# Altium project 十二进十二出.PrjPcb
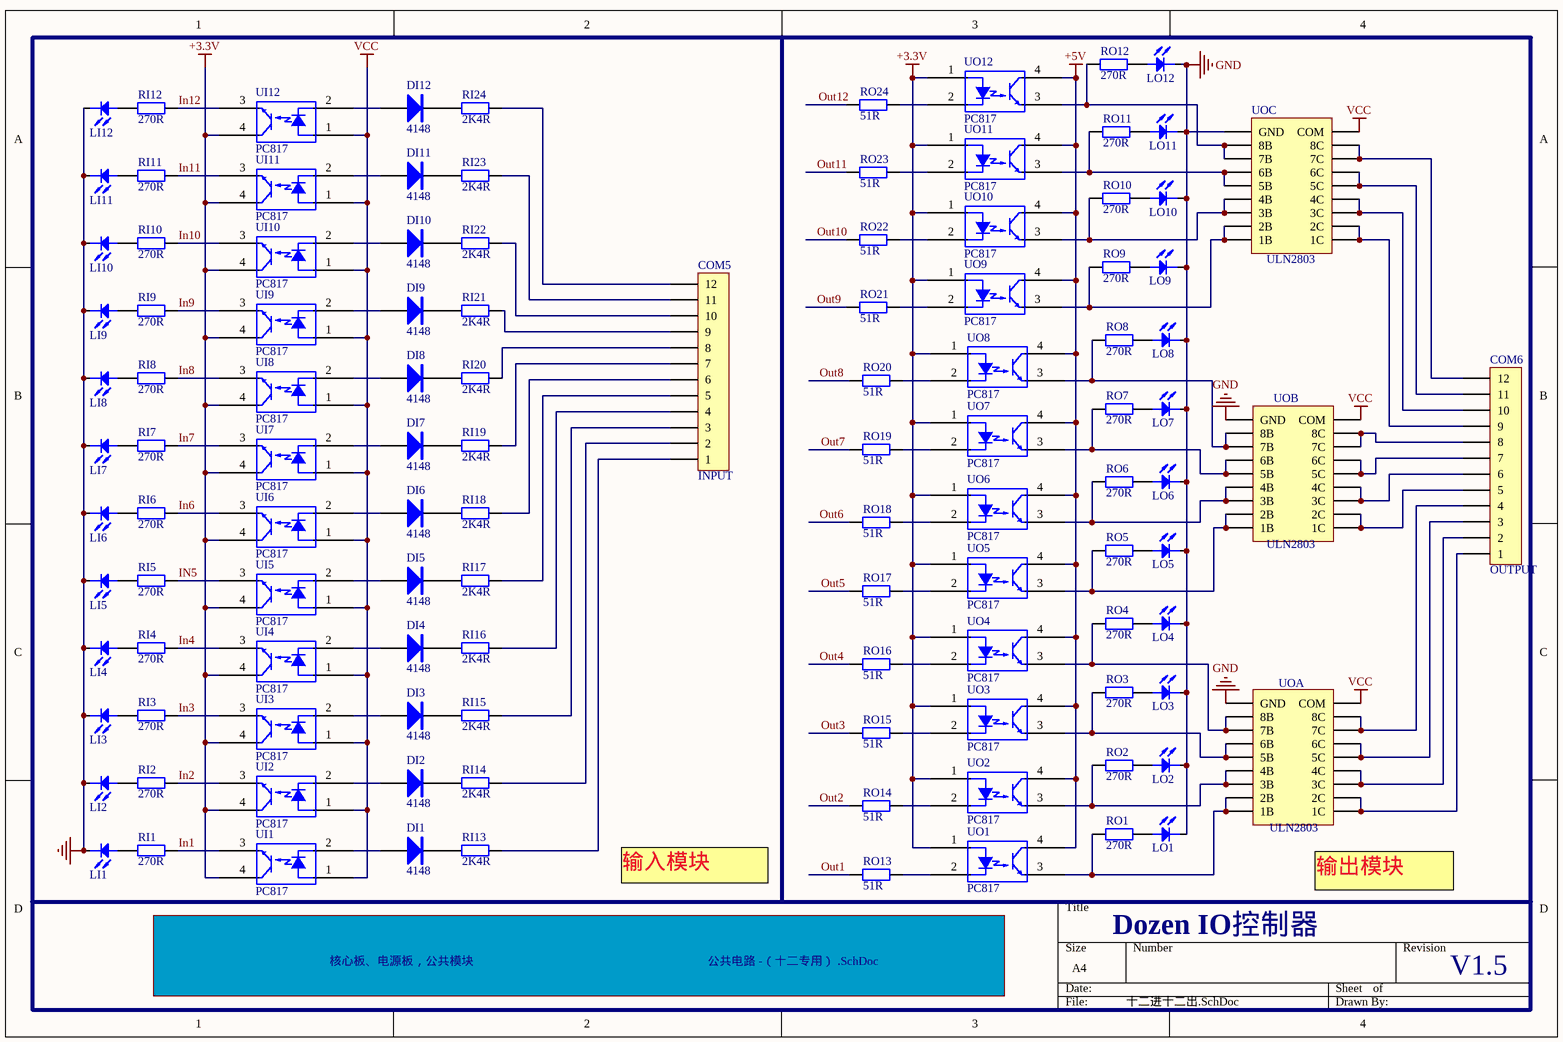
[diagram p0: 十二进十二出.SchDoc]
2 sheets, 184 parts. Net scope: global (net labels, ports and power ports of the same name join across sheets).
Board file: 十二进十二出 .PcbDoc
Sheets:
  十二进十二出.SchDoc
    核心板、电源板，公共模块 = 公共电路 -（十二专用） .SchDoc

## Sheet 十二进十二出.SchDoc: Dozen IO控制器
size A4; Revision: V1.5; SheetNumber: 0; SheetTotal: 0; DrawnBy: 小熊

### Parts
COM5  INPUT  [CON12-5.1卧上]
COM6  OUTPUT  [CON12-5.1卧下]
DI1  4148  [1206C]
DI2  4148  [1206C]
DI3  4148  [1206C]
DI4  4148  [1206C]
DI5  4148  [1206C]
DI6  4148  [1206C]
DI7  4148  [1206C]
DI8  4148  [1206C]
DI9  4148  [1206C]
DI10  4148  [1206C]
DI11  4148  [1206C]
DI12  4148  [1206C]
LI1  LED  [SMDLED]  (value not drawn)
LI2  LED  [SMDLED]  (value not drawn)
LI3  LED  [SMDLED]  (value not drawn)
LI4  LED  [SMDLED]  (value not drawn)
LI5  LED  [SMDLED]  (value not drawn)
LI6  LED  [SMDLED]  (value not drawn)
LI7  LED  [SMDLED]  (value not drawn)
LI8  LED  [SMDLED]  (value not drawn)
LI9  LED  [SMDLED]  (value not drawn)
LI10  LED  [SMDLED]  (value not drawn)
LI11  LED  [SMDLED]  (value not drawn)
LI12  LED  [SMDLED]  (value not drawn)
LO1  LED  [SMDLED]  (value not drawn)
LO2  LED  [SMDLED]  (value not drawn)
LO3  LED  [SMDLED]  (value not drawn)
LO4  LED  [SMDLED]  (value not drawn)
LO5  LED  [SMDLED]  (value not drawn)
LO6  LED  [SMDLED]  (value not drawn)
LO7  LED  [SMDLED]  (value not drawn)
LO8  LED  [SMDLED]  (value not drawn)
LO9  LED  [SMDLED]  (value not drawn)
LO10  LED  [SMDLED]  (value not drawn)
LO11  LED  [SMDLED]  (value not drawn)
LO12  LED  [SMDLED]  (value not drawn)
RI1  270R  [0603A]
RI2  270R  [0603A]
RI3  270R  [0603A]
RI4  270R  [0603A]
RI5  270R  [0603A]
RI6  270R  [0603A]
RI7  270R  [0603A]
RI8  270R  [0603A]
RI9  270R  [0603A]
RI10  270R  [0603A]
RI11  270R  [0603A]
RI12  270R  [0603A]
RI13  2K4R  [0603A]
RI14  2K4R  [0603A]
RI15  2K4R  [0603A]
RI16  2K4R  [0603A]
RI17  2K4R  [0603A]
RI18  2K4R  [0603A]
RI19  2K4R  [0603A]
RI20  2K4R  [0603A]
RI21  2K4R  [0603A]
RI22  2K4R  [0603A]
RI23  2K4R  [0603A]
RI24  2K4R  [0603A]
RO1  270R  [0603A]
RO2  270R  [0603A]
RO3  270R  [0603A]
RO4  270R  [0603A]
RO5  270R  [0603A]
RO6  270R  [0603A]
RO7  270R  [0603A]
RO8  270R  [0603A]
RO9  270R  [0603A]
RO10  270R  [0603A]
RO11  270R  [0603A]
RO12  270R  [0603A]
RO13  51R  [0603A]
RO14  51R  [0603A]
RO15  51R  [0603A]
RO16  51R  [0603A]
RO17  51R  [0603A]
RO18  51R  [0603A]
RO19  51R  [0603A]
RO20  51R  [0603A]
RO21  51R  [0603A]
RO22  51R  [0603A]
RO23  51R  [0603A]
RO24  51R  [0603A]
UI1  PC817  [PC817]
UI2  PC817  [PC817]
UI3  PC817  [PC817]
UI4  PC817  [PC817]
UI5  PC817  [PC817]
UI6  PC817  [PC817]
UI7  PC817  [PC817]
UI8  PC817  [PC817]
UI9  PC817  [PC817]
UI10  PC817  [PC817]
UI11  PC817  [PC817]
UI12  PC817  [PC817]
UO1  PC817  [PC817]
UO2  PC817  [PC817]
UO3  PC817  [PC817]
UO4  PC817  [PC817]
UO5  PC817  [PC817]
UO6  PC817  [PC817]
UO7  PC817  [PC817]
UO8  PC817  [PC817]
UO9  PC817  [PC817]
UO10  PC817  [PC817]
UO11  PC817  [PC817]
UO12  PC817  [PC817]
UOA  ULN2803  [sol18]
UOB  ULN2803  [sol18]
UOC  ULN2803  [sol18]

### Sub-sheets
核心板、电源板，公共模块 = 公共电路 -（十二专用） .SchDoc: no entries

### Nets
+3.3V: UI1.4(COL) UI2.4(COL) UI3.4(COL) UI4.4(COL) UI5.4(COL) UI6.4(COL) UI7.4(COL) UI8.4(COL) UI9.4(COL) UI10.4(COL) UI11.4(COL) UI12.4(COL) UO1.1(ANODE) UO2.1(ANODE) UO3.1(ANODE) UO4.1(ANODE) UO5.1(ANODE) UO6.1(ANODE) UO7.1(ANODE) UO8.1(ANODE) UO9.1(ANODE) UO10.1(ANODE) UO11.1(ANODE) UO12.1(ANODE)
+5V: UO1.4(COL) UO2.4(COL) UO3.4(COL) UO4.4(COL) UO5.4(COL) UO6.4(COL) UO7.4(COL) UO8.4(COL) UO9.4(COL) UO10.4(COL) UO11.4(COL) UO12.4(COL)
GND: LI1.K LI2.K LI3.K LI4.K LI5.K LI6.K LI7.K LI8.K LI9.K LI10.K LI11.K LI12.K LO1.K LO2.K LO3.K LO4.K LO5.K LO6.K LO7.K LO8.K LO9.K LO10.K LO11.K LO12.K UOA.9(GND) UOB.9(GND) UOC.9(GND)
VCC: UI1.1(ANODE) UI2.1(ANODE) UI3.1(ANODE) UI4.1(ANODE) UI5.1(ANODE) UI6.1(ANODE) UI7.1(ANODE) UI8.1(ANODE) UI9.1(ANODE) UI10.1(ANODE) UI11.1(ANODE) UI12.1(ANODE) UOA.10(COM) UOB.10(COM) UOC.10(COM)
In1: RI1.1 UI1.3(EMIT)
In2: RI2.1 UI2.3(EMIT)
In3: RI3.1 UI3.3(EMIT)
In4: RI4.1 UI4.3(EMIT)
IN5: RI5.1 UI5.3(EMIT)
In6: RI6.1 UI6.3(EMIT)
In7: RI7.1 UI7.3(EMIT)
In8: RI8.1 UI8.3(EMIT)
In9: RI9.1 UI9.3(EMIT)
In10: RI10.1 UI10.3(EMIT)
In11: RI11.1 UI11.3(EMIT)
In12: RI12.1 UI12.3(EMIT)
Out1: RO13.1
Out2: RO14.1
Out3: RO15.1
Out4: RO16.1
Out5: RO17.1
Out6: RO18.1
Out7: RO19.1
Out8: RO20.1
Out9: RO21.1
Out10: RO22.1
Out11: RO23.1
Out12: RO24.1
NetCOM5_1: COM5.1 RI13.2
NetCOM5_2: COM5.2 RI14.2
NetCOM5_3: COM5.3 RI15.2
NetCOM5_4: COM5.4 RI16.2
NetCOM5_5: COM5.5 RI17.2
NetCOM5_6: COM5.6 RI18.2
NetCOM5_7: COM5.7 RI19.2
NetCOM5_8: COM5.8 RI20.2
NetCOM5_9: COM5.9 RI21.2
NetCOM5_10: COM5.10 RI22.2
NetCOM5_11: COM5.11 RI23.2
NetCOM5_12: COM5.12 RI24.2
NetCOM6_1: COM6.1 UOA.17(2C) UOA.18(1C)
NetCOM6_2: COM6.2 UOA.15(4C) UOA.16(3C)
NetCOM6_3: COM6.3 UOA.13(6C) UOA.14(5C)
NetCOM6_4: COM6.4 UOA.11(8C) UOA.12(7C)
NetCOM6_5: COM6.5 UOB.17(2C) UOB.18(1C)
NetCOM6_6: COM6.6 UOB.15(4C) UOB.16(3C)
NetCOM6_7: COM6.7 UOB.13(6C) UOB.14(5C)
NetCOM6_8: COM6.8 UOB.11(8C) UOB.12(7C)
NetCOM6_9: COM6.9 UOC.17(2C) UOC.18(1C)
NetCOM6_10: COM6.10 UOC.15(4C) UOC.16(3C)
NetCOM6_11: COM6.11 UOC.13(6C) UOC.14(5C)
NetCOM6_12: COM6.12 UOC.11(8C) UOC.12(7C)
NetDI1_A: DI1.A UI1.2(CATH)
NetDI1_K: DI1.K RI13.1
NetDI2_A: DI2.A UI2.2(CATH)
NetDI2_K: DI2.K RI14.1
NetDI3_A: DI3.A UI3.2(CATH)
NetDI3_K: DI3.K RI15.1
NetDI4_A: DI4.A UI4.2(CATH)
NetDI4_K: DI4.K RI16.1
NetDI5_A: DI5.A UI5.2(CATH)
NetDI5_K: DI5.K RI17.1
NetDI6_A: DI6.A UI6.2(CATH)
NetDI6_K: DI6.K RI18.1
NetDI7_A: DI7.A UI7.2(CATH)
NetDI7_K: DI7.K RI19.1
NetDI8_A: DI8.A UI8.2(CATH)
NetDI8_K: DI8.K RI20.1
NetDI9_A: DI9.A UI9.2(CATH)
NetDI9_K: DI9.K RI21.1
NetDI10_A: DI10.A UI10.2(CATH)
NetDI10_K: DI10.K RI22.1
NetDI11_A: DI11.A UI11.2(CATH)
NetDI11_K: DI11.K RI23.1
NetDI12_A: DI12.A UI12.2(CATH)
NetDI12_K: DI12.K RI24.1
NetLI1_A: LI1.A RI1.2
NetLI2_A: LI2.A RI2.2
NetLI3_A: LI3.A RI3.2
NetLI4_A: LI4.A RI4.2
NetLI5_A: LI5.A RI5.2
NetLI6_A: LI6.A RI6.2
NetLI7_A: LI7.A RI7.2
NetLI8_A: LI8.A RI8.2
NetLI9_A: LI9.A RI9.2
NetLI10_A: LI10.A RI10.2
NetLI11_A: LI11.A RI11.2
NetLI12_A: LI12.A RI12.2
NetLO1_A: LO1.A RO1.2
NetLO2_A: LO2.A RO2.2
NetLO3_A: LO3.A RO3.2
NetLO4_A: LO4.A RO4.2
NetLO5_A: LO5.A RO5.2
NetLO6_A: LO6.A RO6.2
NetLO7_A: LO7.A RO7.2
NetLO8_A: LO8.A RO8.2
NetLO9_A: LO9.A RO9.2
NetLO10_A: LO10.A RO10.2
NetLO11_A: LO11.A RO11.2
NetLO12_A: LO12.A RO12.2
NetRO1_1: RO1.1 UO1.3(EMIT) UOA.1(1B) UOA.2(2B)
NetRO2_1: RO2.1 UO2.3(EMIT) UOA.3(3B) UOA.4(4B)
NetRO3_1: RO3.1 UO3.3(EMIT) UOA.5(5B) UOA.6(6B)
NetRO4_1: RO4.1 UO4.3(EMIT) UOA.7(7B) UOA.8(8B)
NetRO5_1: RO5.1 UO5.3(EMIT) UOB.1(1B) UOB.2(2B)
NetRO6_1: RO6.1 UO6.3(EMIT) UOB.3(3B) UOB.4(4B)
NetRO7_1: RO7.1 UO7.3(EMIT) UOB.5(5B) UOB.6(6B)
NetRO8_1: RO8.1 UO8.3(EMIT) UOB.7(7B) UOB.8(8B)
NetRO9_1: RO9.1 UO9.3(EMIT) UOC.1(1B) UOC.2(2B)
NetRO10_1: RO10.1 UO10.3(EMIT) UOC.3(3B) UOC.4(4B)
NetRO11_1: RO11.1 UO11.3(EMIT) UOC.5(5B) UOC.6(6B)
NetRO12_1: RO12.1 UO12.3(EMIT) UOC.7(7B) UOC.8(8B)
NetRO13_2: RO13.2 UO1.2(CATH)
NetRO14_2: RO14.2 UO2.2(CATH)
NetRO15_2: RO15.2 UO3.2(CATH)
NetRO16_2: RO16.2 UO4.2(CATH)
NetRO17_2: RO17.2 UO5.2(CATH)
NetRO18_2: RO18.2 UO6.2(CATH)
NetRO19_2: RO19.2 UO7.2(CATH)
NetRO20_2: RO20.2 UO8.2(CATH)
NetRO21_2: RO21.2 UO9.2(CATH)
NetRO22_2: RO22.2 UO10.2(CATH)
NetRO23_2: RO23.2 UO11.2(CATH)
NetRO24_2: RO24.2 UO12.2(CATH)

### Notes on the sheet
- 输入模块
- (near UOA) 输出模块

### Library data of the parts
COM5 COM6 = CON12
RI1-RI24 RO1-RO24 = Res2: Resistor; Value: 1K; Published: 8-Jun-2000; LatestRevisionDate: 17-Jul-2002; LatestRevisionNote: Re-released for DXP Platform.; PackageReference: AXIAL-0.4; Publisher: Altium Limited
UI1-UI12 UO1-UO12 = TLP521-1: Single NPN PhotoTransistor OptoCoupler.

## Sheet 公共电路 -（十二专用） .SchDoc: Dozen IO控制器
size A4; Revision: V1.5; Time: 2014年3月27日11:29:06
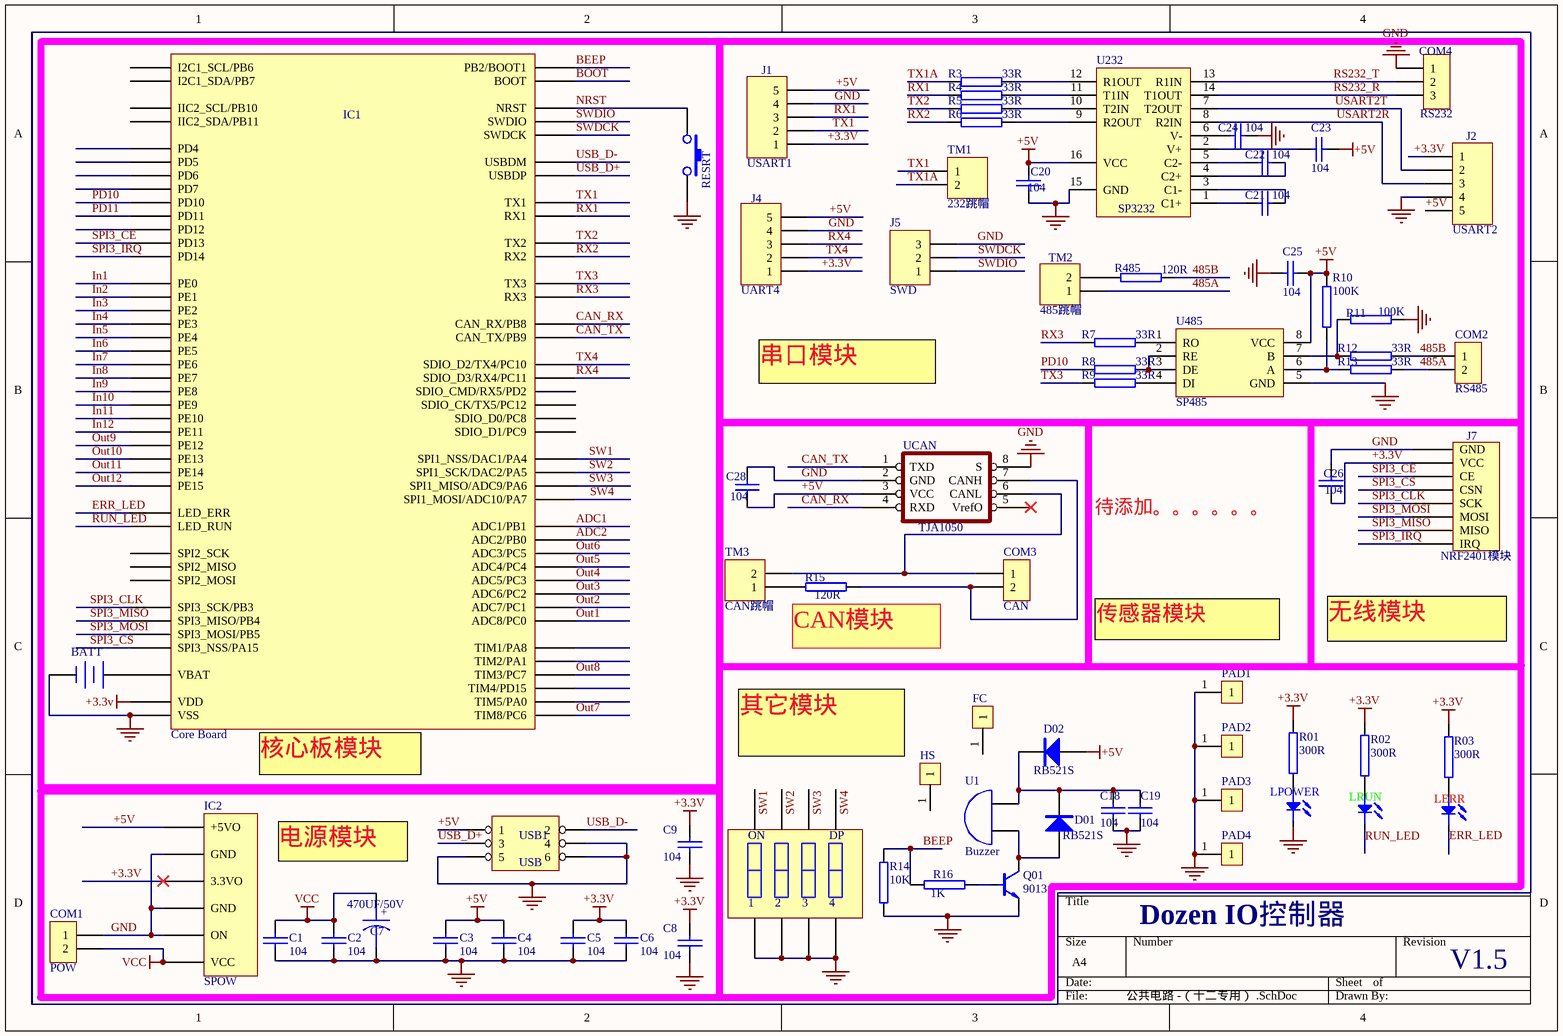
[diagram p1: 公共电路 -（十二专用） .SchDoc]

### Parts
BATT  电源底座  [MINI-BAT]  (value not drawn)
C1  104  [0603A]
C2  104  [0603A]
C3  104  [0603A]
C4  104  [0603A]
C5  104  [0603A]
C6  104  [0603A]
C7  470UF/50V  [电解电容10mm]
C8  104  [0603A]
C9  104  [0603A]
C18  104  [0603A]
C19  104  [0603A]
C20  104  [0603A]
C21  104  [0603A]
C22  104  [0603A]
C23  104  [0603A]
C24  104  [0603A]
C25  104  [0603A]
C26  104  [0603A]
C28  104  [0603A]
COM1  POW  [CON2-5.1卧]
COM2  RS485  [CON2-5.1卧]
COM3  CAN  [CON2-5.1卧]
COM4  RS232  [CON3-5.1卧]
D01  RB521S  [贴片二极管]
D02  RB521S  [贴片二极管]
FC  (no value)  [fc]
HS  (no value)  [HS]
IC1  Core Board  [核心板-物联网1]
IC2  SPOW  [电源板]
J1  USART1  [2.54排针1*5]
J2  USART2  [2.54排针1*5]
J4  UART4  [2.54排针1*5]
J5  SWD  [2.54排针1*3]
J7  NRF2401模块  [NRF24L01]
LERR  ERR  [LED2.5]  (value not drawn)
LPOWER  PLED  [LED2.5]  (value not drawn)
LRUN  RUN  [LED2.5]  (value not drawn)
PAD1  PAD  [PAD]  (value not drawn)
PAD2  PAD  [PAD]  (value not drawn)
PAD3  PAD  [PAD]  (value not drawn)
PAD4  PAD  [PAD]  (value not drawn)
Q01  9013  [SOT23]
R01  300R  [0603A]
R02  300R  [0603A]
R03  300R  [0603A]
R3  33R  [0603A]
R4  33R  [0603A]
R5  33R  [0603A]
R6  33R  [0603A]
R7  33R  [0603A]
R8  33R  [0603A]
R9  33R  [0603A]
R10  100K  [0603A]
R11  100K  [0603A]
R12  33R  [0603A]
R13  33R  [0603A]
R14  10K  [0603A]
R15  120R  [0603A]
R16  1K  [0603A]
R485  120R  [0603A]
S1  拨码开关*4  [SWITCH*4]  (value not drawn)
S2  RESRT  [SW-PB2]
TM1  232跳帽  [2.54排针1*2]
TM2  485跳帽  [2.54排针1*2]
TM3  CAN跳帽  [2.54排针1*2]
U1  Buzzer  [蜂鸣器]
U232  SP3232  [TSSOP16]
U485  SP485  [SO8_L]
UCAN  TJA1050  [SO8_L]
USB1  USB  [USB-B3]

### Nets
+3.3V: C5.1 C6.1 C8.1 C9.1 C26.2 IC1.2(VDD) IC2.3(3.3VO) J1.1 J2.1 J4.1 J7.2(VCC) R01.1 R02.1 R03.1
+5V: C3.1 C4.1 C20.1 C23.2 C25.2 C28.2 D02.A IC2.1(+5VO) J1.5 J2.5 J4.5 R10.2 U232.16(VCC) U485.8(VCC) UCAN.3(VCC) USB1.1
GND: BATT.2(-) C1.2 C2.2 C3.2 C4.2 C5.2 C6.2 C7.2 C8.2 C9.2 C18.2 C19.2 C20.2 C24.2 C25.1 C26.1 C28.1 COM1.1 COM4.1 IC1.1(VSS) IC2.2(GND) IC2.4(GND) IC2.5(ON) J1.4 J2.4 J4.4 J5.3 J7.1(GND) LPOWER.K PAD1.1 PAD2.1 PAD3.1 PAD4.1 Q01.2(e) R11.2 R14.1 S1.5 S1.6 S1.7 S1.8 S2.2 U232.15(GND) U485.5(GND) UCAN.2(GND) UCAN.8(S) USB1.4 USB1.5 USB1.6
VCC: C1.1 C2.1 C7.1 COM1.2 IC2.6(VCC)
485A: COM2.2 R13.2 TM2.1
485B: COM2.1 R12.2 R485.2
ADC1: IC1.33(ADC1/PB1)
ADC2: IC1.34(ADC2/PB0)
BEEP: IC1.31(PB2/BOOT1) R14.2 R16.1
BOOT: IC1.3(BOOT)
CAN_RX: IC1.68(CAN_RX/PB8) UCAN.4(RXD)
CAN_TX: IC1.67(CAN_TX/PB9) UCAN.1(TXD)
ERR_LED: IC1.11(LED_ERR) LERR.K
In1: IC1.58(PE0)
In2: IC1.57(PE1)
In3: IC1.56(PE2)
In4: IC1.55(PE3)
IN5: IC1.54(PE4)
In6: IC1.53(PE5)
In7: IC1.52(PE6)
In8: IC1.51(PE7)
In9: IC1.30(PE8)
In10: IC1.29(PE9)
In11: IC1.28(PE10)
In12: IC1.27(PE11)
NRST: IC1.4(NRST) S2.1
Out1: IC1.49(ADC8/PC0)
Out2: IC1.50(ADC7/PC1)
Out3: IC1.47(ADC6/PC2)
Out4: IC1.48(ADC5/PC3)
Out5: IC1.36(ADC4/PC4)
Out6: IC1.35(ADC3/PC5)
Out7: IC1.41(TIM8/PC6)
Out8: IC1.44(TIM3/PC7)
Out9: IC1.26(PE12)
Out10: IC1.25(PE13)
Out11: IC1.24(PE14)
Out12: IC1.23(PE15)
PD10: IC1.13(PD10) R8.1
PD11: IC1.62(PD11)
RS232_R: COM4.3 U232.14(T1OUT)
RS232_T: COM4.2 U232.13(R1IN)
RUN_LED: IC1.12(LED_RUN) LRUN.K
RX1: IC1.10(RX1) J1.3 R4.1
RX2: IC1.18(RX2) R6.1
RX3: IC1.20(RX3) R7.1
RX4: IC1.80(SDIO_D3/RX4/PC11) J4.3
SPI3_CE: IC1.60(PD13) J7.3(CE)
SPI3_CLK: IC1.73(SPI3_SCK/PB3) J7.5(SCK)
SPI3_CS: IC1.74(SPI3_NSS/PA15) J7.4(CSN)
SPI3_IRQ: IC1.59(PD14) J7.8(IRQ)
SPI3_MISO: IC1.72(SPI3_MISO/PB4) J7.7(MISO)
SPI3_MOSI: IC1.71(SPI3_MOSI/PB5) J7.6(MOSI)
SW1: IC1.39(SPI1_NSS/DAC1/PA4) S1.1
SW2: IC1.40(SPI1_SCK/DAC2/PA5) S1.2
SW3: IC1.37(SPI1_MISO/ADC9/PA6) S1.3
SW4: IC1.38(SPI1_MOSI/ADC10/PA7) S1.4
SWDCK: IC1.6(SWDCK) J5.2
SWDIO: IC1.5(SWDIO) J5.1
TX1: IC1.9(TX1) J1.2 TM1.1
TX1A: R3.1 TM1.2
TX2: IC1.17(TX2) R5.1
TX3: IC1.19(TX3) R9.1
TX4: IC1.79(SDIO_D2/TX4/PC10) J4.2
USART2R: J2.3 U232.8(R2IN)
USART2T: J2.2 U232.7(T2OUT)
USB_D+: IC1.8(USBDP) USB1.3
USB_D-: IC1.7(USBDM) USB1.2
NetBATT_1: BATT.1(+) IC1.32(VBAT)
NetC18_1: C18.1 C19.1 D01.K D02.K U1.1(A)
NetC21_1: C21.1 U232.1(C1+)
NetC21_2: C21.2 U232.3(C1-)
NetC22_1: C22.1 U232.5(C2-)
NetC22_2: C22.2 U232.4(C2+)
NetC23_1: C23.1 U232.2(V+)
NetC24_1: C24.1 U232.6(V-)
NetCOM3_1: COM3.1 TM3.2 UCAN.6(CANL)
NetCOM3_2: COM3.2 R15.2 UCAN.7(CANH)
NetD01_A: D01.A Q01.3(c) U1.2(B)
NetLERR_A: LERR.A R03.2
NetLPOWER_A: LPOWER.A R01.2
NetLRUN_A: LRUN.A R02.2
NetQ01_1: Q01.1(b) R16.2
NetR3_2: R3.2 U232.12(R1OUT)
NetR4_2: R4.2 U232.11(T1IN)
NetR5_2: R5.2 U232.10(T2IN)
NetR6_2: R6.2 U232.9(R2OUT)
NetR7_2: R7.2 U485.1(RO)
NetR8_2: R8.2 U485.2(RE) U485.3(DE)
NetR9_2: R9.2 U485.4(DI)
NetR10_1: R10.1 R13.1 U485.6(A)
NetR11_1: R11.1 R12.1 U485.7(B)
NetR15_1: R15.1 TM3.1
NetR485_1: R485.1 TM2.2

Not connected (* = marked no-connect by the designer): FC 1; HS 1; IC1 14(SPI2_SCK) 15(SPI2_MISO) 16(SPI2_MOSI) 21(IIC2_SDA/PB11) 22(IIC2_SCL/PB10) 42(TIM4/PD15) 43(TIM1/PA8) 45(TIM5/PA0) 46(TIM2/PA1) 61(PD12) 63(PD4) 64(PD5) 65(PD6) 66(PD7) 69(I2C1_SDA/PB7) 70(I2C1_SCL/PB6) 75(SDIO_D1/PC9) 76(SDIO_D0/PC8) 77(SDIO_CMD/RX5/PD2) 78(SDIO_CK/TX5/PC12); UCAN 5(VrefO)*

### Notes on the sheet
- 串口模块
- (near C26) 待添加。。。。。。
- (near R15) CAN模块
- (near PAD1) 传感器模块
- (near J7) 无线模块
- (near IC1) 核心板模块
- (near HS) 其它模块
- 电源模块
- (in symbol CAPACITOR POL) +
- (in symbol 拨码开关*4) ON; DP

### Library data of the parts
BATT = Battery: XH414H; Published: 24-Mar-1999; LatestRevisionDate: 17-Jul-2002; LatestRevisionNote: Re-released for DXP Platform.; PackageReference: BAT-2; Publisher: Altium Limited; PackageDescription: Battery; 2 Leads
C1-C6 C8 C9 C18-C26 C28 = CAP: Capacitor
C7 = CAPACITOR POL: Capacitor
COM1-COM3 = CON2
COM4 = CON3
FC HS = PAD
IC1 = 物联网核心板
J1 J2 J4 = Header 5: Header, 4-Pin; LatestRevisionDate: 17-Jul-2002; LatestRevisionNote: Re-released for DXP Platform.; Publisher: Altium Limited
J5 = Header 3: Header, 4-Pin; LatestRevisionDate: 17-Jul-2002; LatestRevisionNote: Re-released for DXP Platform.; Publisher: Altium Limited
LERR LPOWER LRUN = LED
Q01 = NPN
R01 R02 R03 R3-R16 R485 = RES2
S2 = SW-PB
TM1-TM3 = Header 2: Header, 2-Pin; LatestRevisionDate: 17-Jul-2002; LatestRevisionNote: Re-released for DXP Platform.; Publisher: Altium Limited
U232 = SP3232EEA
USB1 = HEADER 3X2

## Nets that join several sheets
+3.3V: 十二进十二出 (24 pins), 公共电路 -（十二专用）  (14 pins)
+5V: 十二进十二出 (12 pins), 公共电路 -（十二专用）  (16 pins)
GND: 十二进十二出 (27 pins), 公共电路 -（十二专用）  (48 pins)
VCC: 十二进十二出 (15 pins), 公共电路 -（十二专用）  (5 pins)
In1: 十二进十二出 (RI1.1 UI1.3), 公共电路 -（十二专用）  (IC1.58)
In2: 十二进十二出 (RI2.1 UI2.3), 公共电路 -（十二专用）  (IC1.57)
In3: 十二进十二出 (RI3.1 UI3.3), 公共电路 -（十二专用）  (IC1.56)
In4: 十二进十二出 (RI4.1 UI4.3), 公共电路 -（十二专用）  (IC1.55)
IN5: 十二进十二出 (RI5.1 UI5.3), 公共电路 -（十二专用）  (IC1.54)
In6: 十二进十二出 (RI6.1 UI6.3), 公共电路 -（十二专用）  (IC1.53)
In7: 十二进十二出 (RI7.1 UI7.3), 公共电路 -（十二专用）  (IC1.52)
In8: 十二进十二出 (RI8.1 UI8.3), 公共电路 -（十二专用）  (IC1.51)
In9: 十二进十二出 (RI9.1 UI9.3), 公共电路 -（十二专用）  (IC1.30)
In10: 十二进十二出 (RI10.1 UI10.3), 公共电路 -（十二专用）  (IC1.29)
In11: 十二进十二出 (RI11.1 UI11.3), 公共电路 -（十二专用）  (IC1.28)
In12: 十二进十二出 (RI12.1 UI12.3), 公共电路 -（十二专用）  (IC1.27)
Out1: 十二进十二出 (RO13.1), 公共电路 -（十二专用）  (IC1.49)
Out2: 十二进十二出 (RO14.1), 公共电路 -（十二专用）  (IC1.50)
Out3: 十二进十二出 (RO15.1), 公共电路 -（十二专用）  (IC1.47)
Out4: 十二进十二出 (RO16.1), 公共电路 -（十二专用）  (IC1.48)
Out5: 十二进十二出 (RO17.1), 公共电路 -（十二专用）  (IC1.36)
Out6: 十二进十二出 (RO18.1), 公共电路 -（十二专用）  (IC1.35)
Out7: 十二进十二出 (RO19.1), 公共电路 -（十二专用）  (IC1.41)
Out8: 十二进十二出 (RO20.1), 公共电路 -（十二专用）  (IC1.44)
Out9: 十二进十二出 (RO21.1), 公共电路 -（十二专用）  (IC1.26)
Out10: 十二进十二出 (RO22.1), 公共电路 -（十二专用）  (IC1.25)
Out11: 十二进十二出 (RO23.1), 公共电路 -（十二专用）  (IC1.24)
Out12: 十二进十二出 (RO24.1), 公共电路 -（十二专用）  (IC1.23)